# Altium schematic sheet Struct.SchDoc
size 420 x 297 mm; Address1: Address1; Address2: Address2; Address3: Address3; Address4: Address4; DocumentNumber: АБВГ.123456.001 Э3; SheetNumber: 1; Scale: 1:1; DocumentType: Схема электрическая принципиальная; FirstReferrence: АБВГ.123456.001
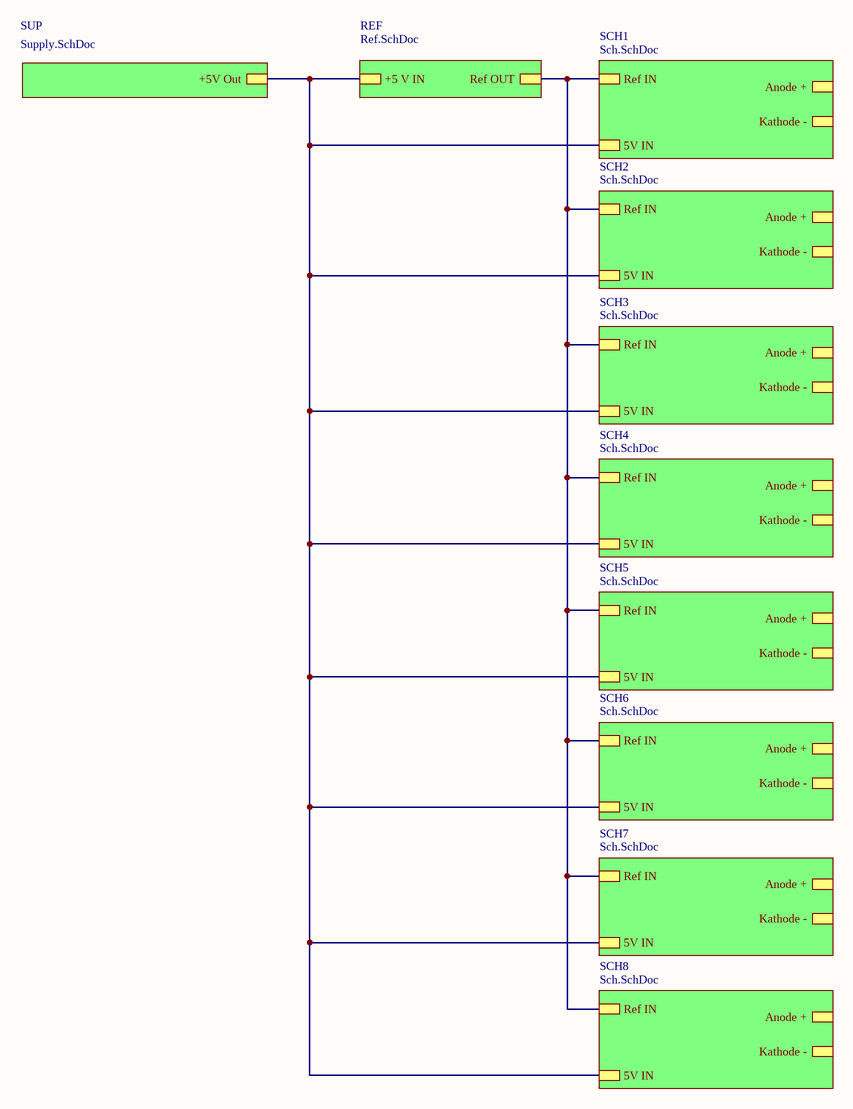
[diagram p0: Struct.SchDoc]

## Sub-sheets
REF = Ref.SchDoc: +5 V IN, Ref OUT
SCH1 = Sch.SchDoc: Ref IN, 5V IN, Anode +, Kathode -
SCH2 = Sch.SchDoc: Ref IN, 5V IN, Anode +, Kathode -
SCH3 = Sch.SchDoc: Ref IN, 5V IN, Anode +, Kathode -
SCH4 = Sch.SchDoc: Ref IN, 5V IN, Anode +, Kathode -
SCH5 = Sch.SchDoc: Ref IN, 5V IN, Anode +, Kathode -
SCH6 = Sch.SchDoc: Ref IN, 5V IN, Anode +, Kathode -
SCH7 = Sch.SchDoc: Ref IN, 5V IN, Anode +, Kathode -
SCH8 = Sch.SchDoc: Ref IN, 5V IN, Anode +, Kathode -
SUP = Supply.SchDoc: +5V Out

## Nets
(unnamed): sheet REF/+5 V IN, sheet SUP/+5V Out, sheet SCH1/5V IN, sheet SCH2/5V IN, sheet SCH3/5V IN, sheet SCH4/5V IN, sheet SCH5/5V IN, sheet SCH6/5V IN, sheet SCH7/5V IN, sheet SCH8/5V IN
(unnamed): sheet REF/Ref OUT, sheet SCH1/Ref IN, sheet SCH2/Ref IN, sheet SCH3/Ref IN, sheet SCH4/Ref IN, sheet SCH5/Ref IN, sheet SCH6/Ref IN, sheet SCH7/Ref IN, sheet SCH8/Ref IN

## Notes on the sheet
- Перв. примен.
- Справ. №
- Подп. и дата
- Инв. № дубл.
- Взам. инв. №
- Разраб.
- Изм.
- Лист
- № докум.
- Подп.
- Дата
- Лит.
- Масса
- Масштаб
- Пров.
- Т.контр.
- Листов
- Инв. № подл.
- Утв.
- Н.контр.
- 2.106-A3
- Копировал
- Формат А3